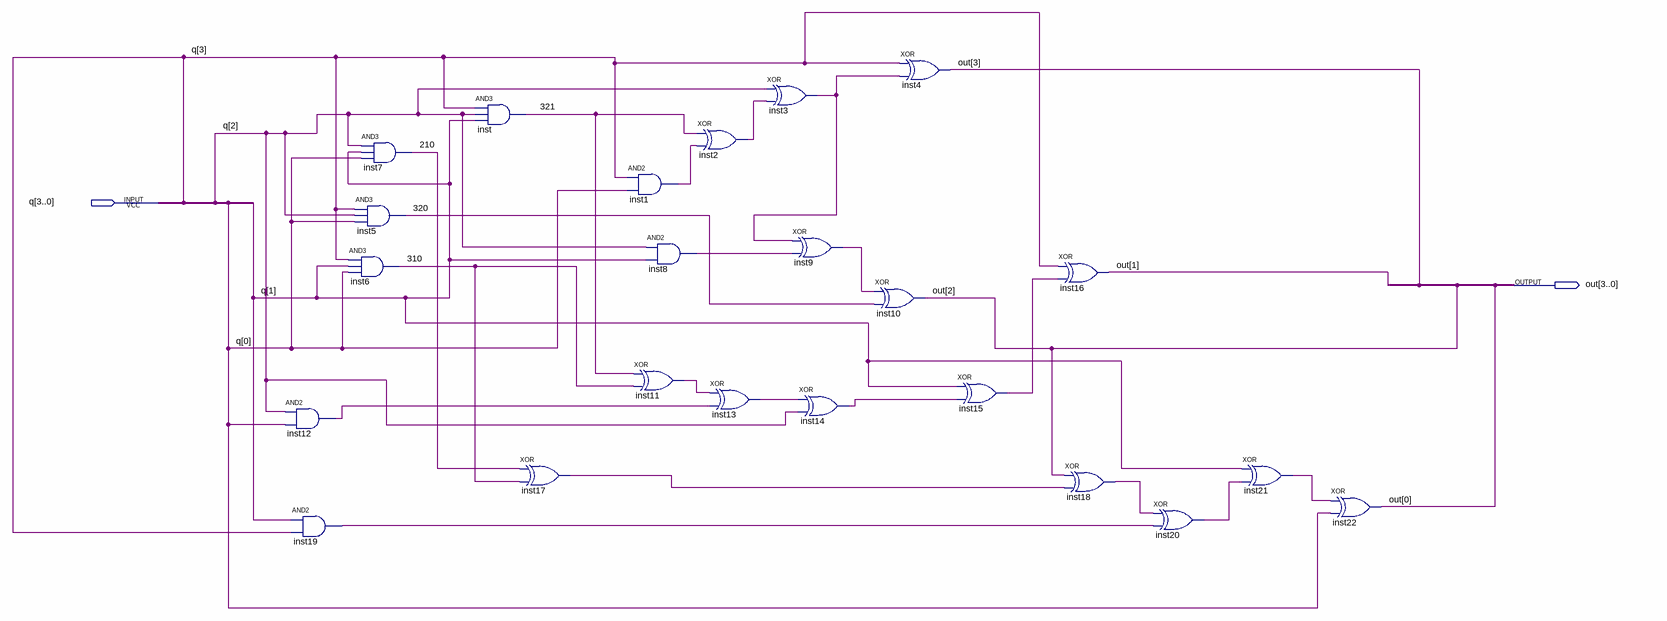
[diagram p0: schematic sheet]
// Quartus schematic inverse.bdf as structural Verilog: 23 symbols, 2 pins
module inverse (
  input  [3:0] q,
  output [3:0] out
);

  wire \210 , \310 , \320 , \321 , inst1_out, inst2_out, inst3_out, inst8_out, inst9_out, inst11_out,
       inst12_out, inst13_out, inst14_out, inst15_out, inst17_out, inst18_out, inst19_out, inst20_out,
       inst21_out;

  and inst12 (inst12_out, q[2], q[0]);
  and inst19 (inst19_out, q[1], q[3]);
  and inst7 (\210 , q[2], q[1], q[0]);
  and inst5 (\320 , q[3], q[2], q[0]);
  and inst6 (\310 , q[3], q[1], q[0]);
  and inst (\321 , q[3], q[2], q[1]);
  xor inst17 (inst17_out, \210 , \310 );
  and inst1 (inst1_out, q[3], q[0]);
  and inst8 (inst8_out, q[2], q[1]);
  xor inst11 (inst11_out, \321 , \310 );
  xor inst2 (inst2_out, \321 , inst1_out);
  xor inst13 (inst13_out, inst11_out, inst12_out);
  xor inst3 (inst3_out, q[2], inst2_out);
  xor inst9 (inst9_out, inst3_out, inst8_out);
  xor inst14 (inst14_out, inst13_out, q[2]);
  xor inst10 (out[2], inst9_out, \320 );
  xor inst4 (out[3], q[3], inst3_out);
  xor inst15 (inst15_out, q[1], inst14_out);
  xor inst16 (out[1], q[3], inst15_out);
  xor inst18 (inst18_out, out[2], inst17_out);
  xor inst20 (inst20_out, inst18_out, inst19_out);
  xor inst21 (inst21_out, q[1], inst20_out);
  xor inst22 (out[0], inst21_out, q[0]);
endmodule
